# EAGLE design mcprog (EAGLE 6.6.0)
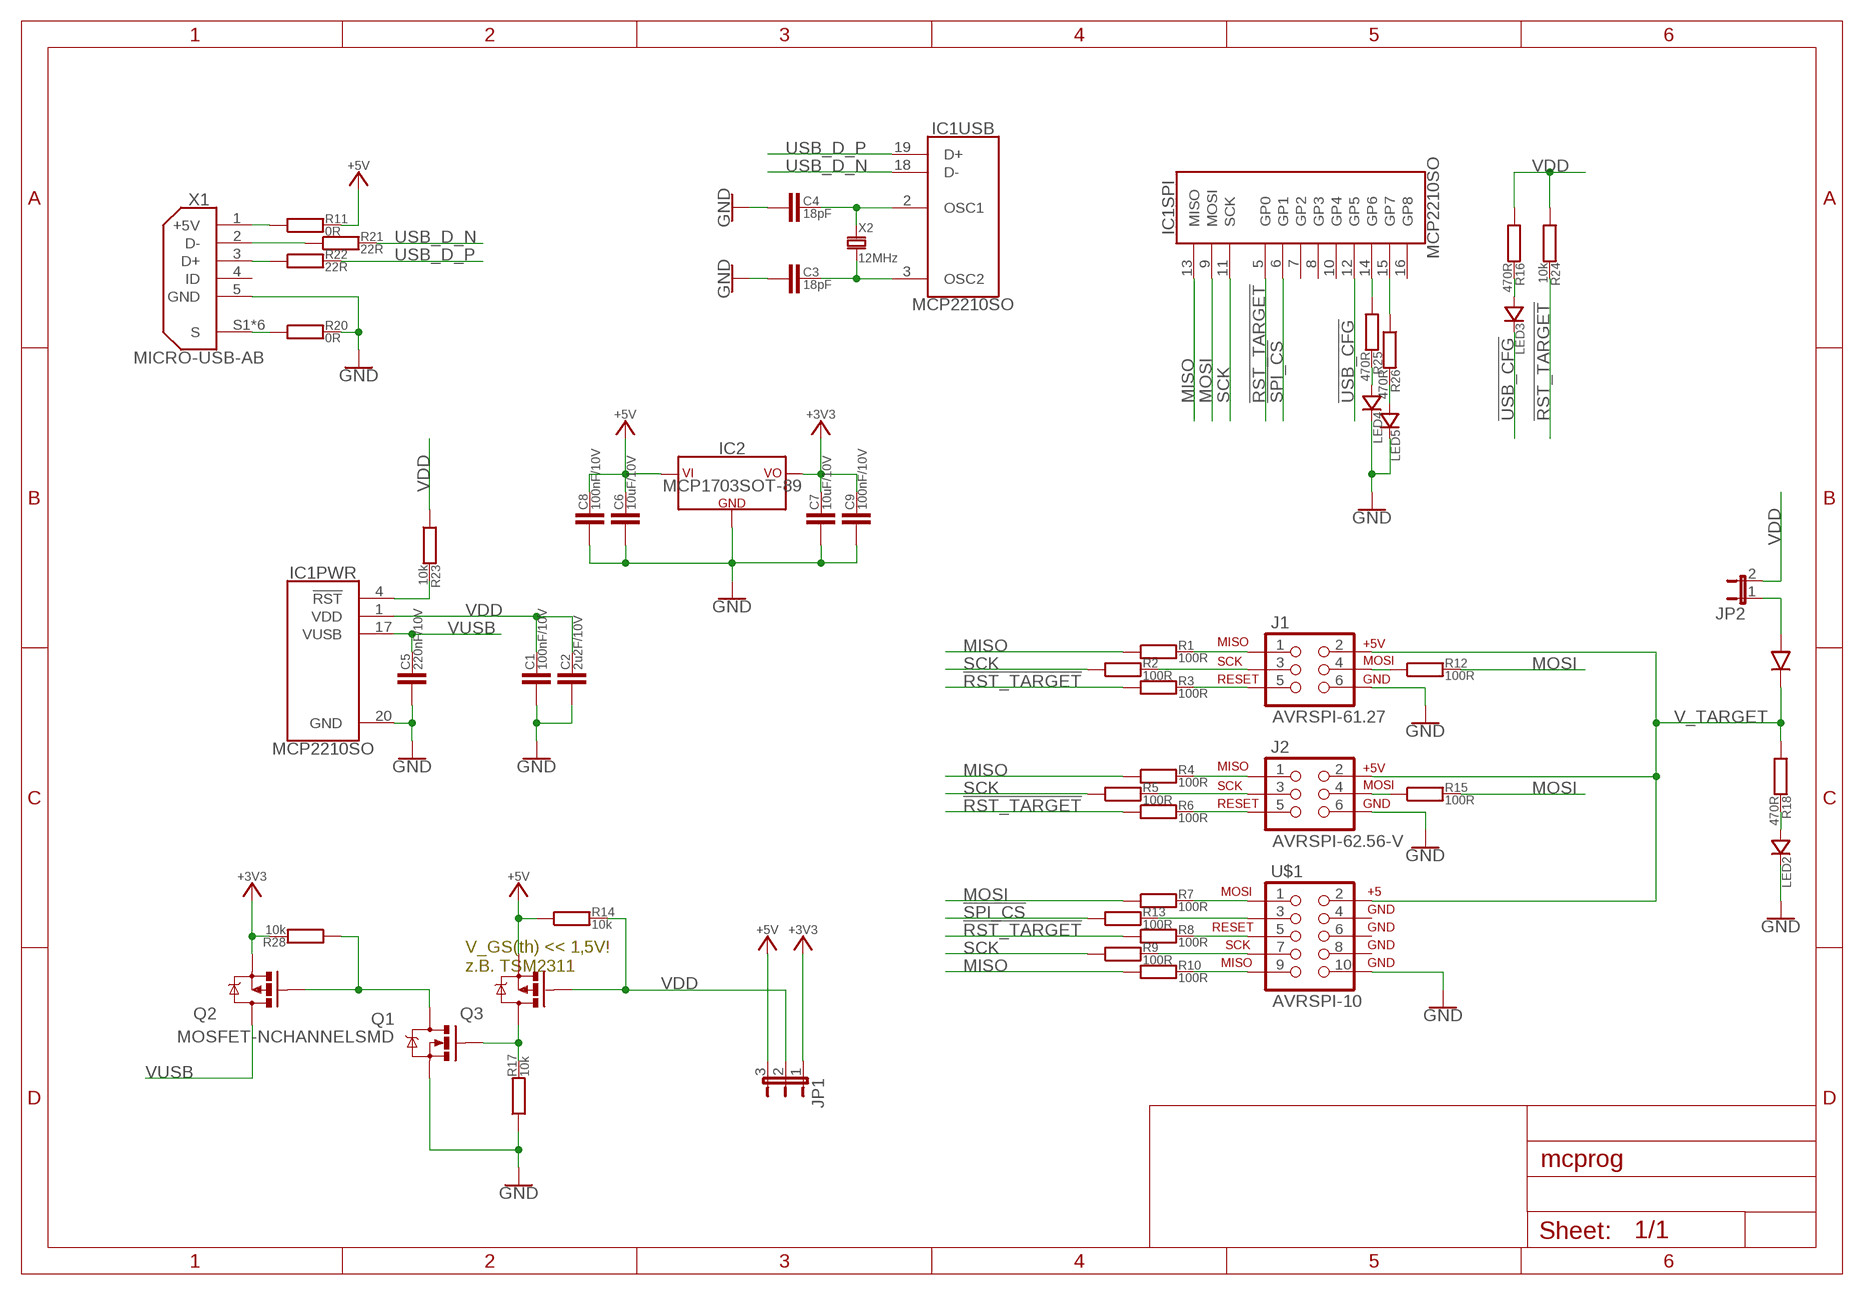
[diagram p0: schematic, sheet 1]

## Parts
C1  100nF/10V  C0603  [C0603]
C2  2u2F/10V  C1206  [C1206]
C3  18pF  C0603  [C0603]
C4  18pF  C0603  [C0603]
C5  220nF/10V  C0603  [C0603]
C6  10uF/10V  C1206  [C1206]
C7  10uF/10V  C1206  [C1206]
C8  100nF/10V  C0603  [C0603]
C9  100nF/10V  C0603  [C0603]
D1  1N5819HW  [SOD123]
IC1  MCP2210SO  [SOIC20-W]
IC2  MCP1703SOT-89  [SOT89]
J1  AVRSPI-61.27  [2X3-1.27]
J2  AVRSPI-62.56-V  [2X3-NS]
JP1  JP2E  [JP2]
JP2  JP1E  [JP1]
LED2  LED0603  [LED0603]
LED3  LED0603  [LED0603]
LED4  LED0603  [LED0603]
LED5  LED0603  [LED0603]
Q1  MOSFET-NCHANNELSMD  [SOT23-3]
Q2  MOSFET-PCHANNEL  [SOT23]
Q3  MOSFET-PCHANNEL  [SOT23]
R1  100R  R0603  [R0603]
R2  100R  R0603  [R0603]
R3  100R  R0603  [R0603]
R4  100R  R0603  [R0603]
R5  100R  R0603  [R0603]
R6  100R  R0603  [R0603]
R7  100R  R0603  [R0603]
R8  100R  R0603  [R0603]
R9  100R  R0603  [R0603]
R10  100R  R0603  [R0603]
R11  0R  R0603  [R0603]
R12  100R  R0603  [R0603]
R13  100R  R0603  [R0603]
R14  10k  R0603  [R0603]
R15  100R  R0603  [R0603]
R16  470R  R0603  [R0603]
R17  10k  R0603  [R0603]
R18  470R  R0603  [R0603]
R20  0R  R0603  [R0603]
R21  22R  R0603  [R0603]
R22  22R  R0603  [R0603]
R23  10k  R0603  [R0603]
R24  10k  R0603  [R0603]
R25  470R  R0603  [R0603]
R26  470R  R0603  [R0603]
R28  10k  R0603  [R0603]
U$1  AVRSPI-10  [AVR_ICSP]
X1  MICRO-USB-AB  [ZX62-B-5PA(11)]
X2  12MHz  CRYSTALHC49UP  [HC49UP]

## Nets
!RST_TARGET!: IC1.5(SPI:GP0) R3.1 R6.1 R8.1 R24.2
!SPI_CS!: IC1.6(SPI:GP1) R13.1
!USB_CFG!: IC1.12(SPI:GP5) LED3.C
+3V3: C7.2 C9.2 IC2.3(VCC) JP1.1 Q2.2(S) R28.2
+5V: C6.2 C8.2 IC2.2(VIN) IC2.4(VIN) JP1.3 Q3.2(S) R11.2 R14.1
GND: C1.1 C2.1 C3.1 C4.1 C5.1 C6.1 C7.1 C8.1 C9.1 IC1.20(PWR:GND) IC2.1(GND) J1.6(GND) J2.6(GND) LED2.C LED4.C LED5.C Q1.2(S) R17.1 R20.2 U$1.10 X1.5(GND)
MISO: IC1.13(SPI:MISO) R1.1 R4.1 R10.1
MOSI: IC1.9(SPI:MOSI) R7.1 R12.2 R15.2
N$1: J1.1(MISO) R1.2
N$2: J1.3(SCK) R2.2
N$3: J1.5(RESET) R3.2
N$4: J2.1(MISO) R4.2
N$5: J2.3(SCK) R5.2
N$6: J2.5(RESET) R6.2
N$7: R7.2 U$1.1
N$8: R8.2 U$1.5
N$9: R9.2 U$1.7
N$10: R10.2 U$1.9
N$11: Q1.1(G) Q3.3(D) R17.2
N$12: LED3.A R16.2
N$13: Q1.3(D) Q2.1(G) R28.1
N$14: J2.4(MOSI) R15.1
N$15: LED2.A R18.2
N$16: IC1.14(SPI:GP6) R25.1
N$17: J1.4(MOSI) R12.1
N$19: R13.2 U$1.3
N$20: C4.2 IC1.2(USB:OSC1) X2.1
N$21: C3.2 IC1.3(USB:OSC2) X2.2
N$22: R21.1 X1.2(D-)
N$23: R22.1 X1.3(D+)
N$24: R11.1 X1.1(+5V)
N$25: R20.1 X1.S1(S) X1.S2(S) X1.S3(S) X1.S4(S) X1.S5(S) X1.S6(S)
N$26: LED4.A R25.2
N$27: D1.A JP2.1
N$29: IC1.4(PWR:!RST!) R23.2
N$32: LED5.A R26.2
N$33: IC1.15(SPI:GP7) R26.1
SCK: IC1.11(SPI:SCK) R2.1 R5.1 R9.1
USB_D_N: IC1.18(USB:D-) R21.2
USB_D_P: IC1.19(USB:D+) R22.2
V_TARGET: D1.C J1.2(+5V) J2.2(+5V) R18.1 U$1.2
VDD: C1.2 C2.2 IC1.1(PWR:VDD) JP1.2 JP2.2 Q3.1(G) R14.2 R16.1 R23.1 R24.1
VUSB: C5.2 IC1.17(PWR:VUSB) Q2.3(D)
Unconnected: IC1.7(SPI:GP2) IC1.8(SPI:GP3) IC1.10(SPI:GP4) IC1.16(SPI:GP8) U$1.4 U$1.6 U$1.8 X1.4(ID)

## Notes on the sheet
- V_GS(th) << 1,5V!
  z.B. TSM2311

## Library data of the parts
C1-C9 = bytewerk-passive:C
D1 = bytewerk-passive:1N5819HW: Si-Diode - Icont=1A; MF: DIODES INC.; MPN: 1N5819HW-7-F; OC_FARNELL: 1773475
IC1 = mcp2210:MCP2210: USB to SPI Master Creative Commons v3.0 CC-BY-SA
IC2 = bytewerk-vreg:MCP1703
J1 J2 = bytewerk-con:AVRSPI-6: 6-PIN AVR ISP Connector
JP1 = jumper:JP2E: JUMPER
JP2 = jumper:JP1E: JUMPER
LED2-LED5 = bytewerk-led:LED0603
Q1 = bytewerk-transistor:MOSFET-NCHANNEL
Q2 Q3 = bytewerk-transistor:MOSFET-PCHANNEL
R1-R18 R20-R26 R28 = bytewerk-passive:R
U$1 = bytewerk-con:AVRSPI-10: AVR ICSP Header This is the standard AVR In Circuit Serial Programming header. Minimal, but includes pin one indicator. Works with standard Olimex programmers. Also look for the 6-pin reduced version. Spark Fun Electronics SKU: PRT-00778
X1 = bytewerk-con:MICRO-USB-AB; MF: HIROSE; MPN: ZX62-AB-5PA(11); OC_MOUSER: 798-ZX62-AB-5PA11
X2 = bytewerk-crystal:CRYSTAL

## Board
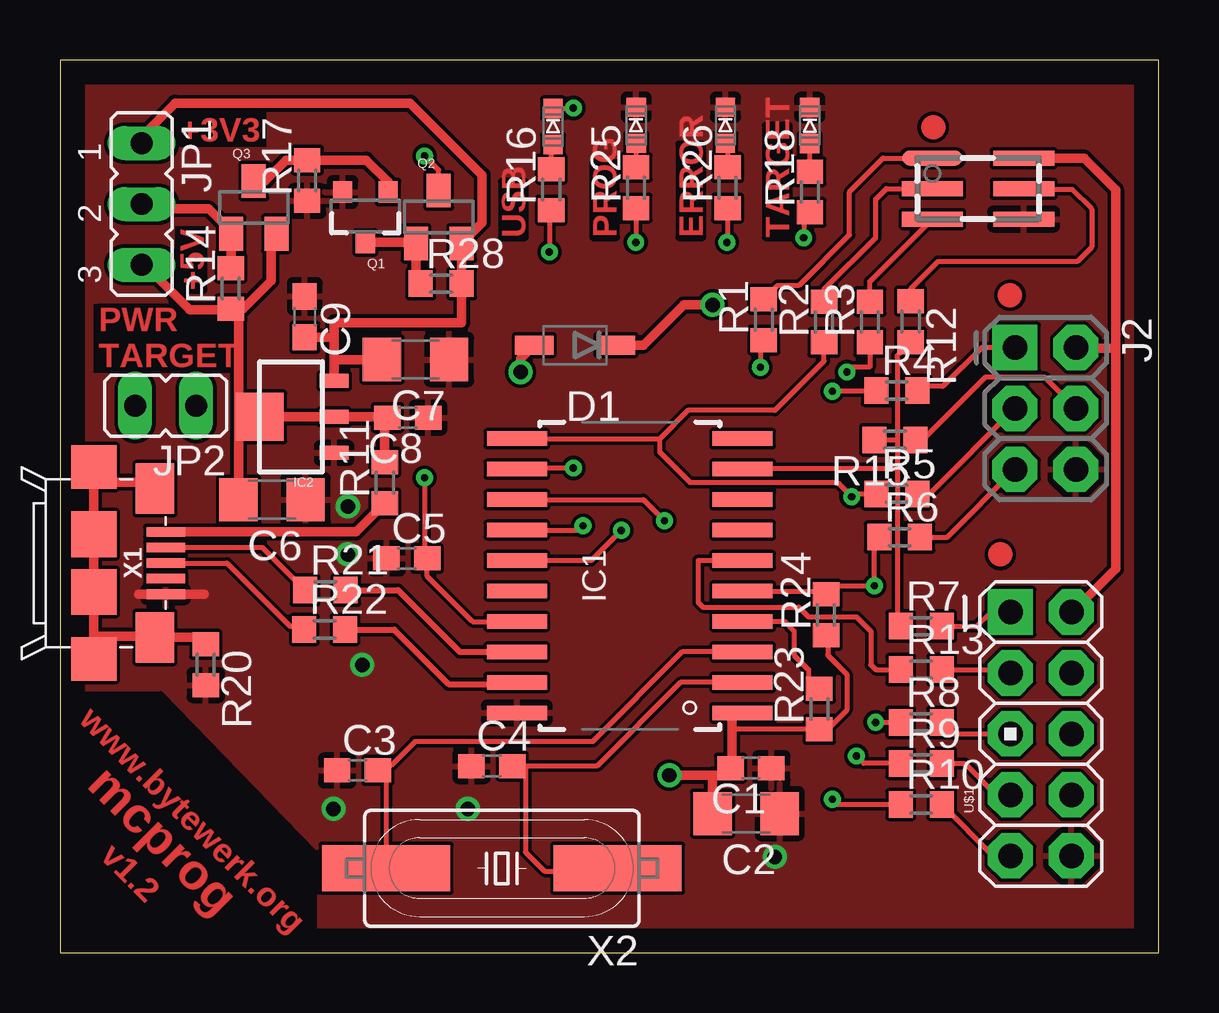
[diagram p1: board, top side]
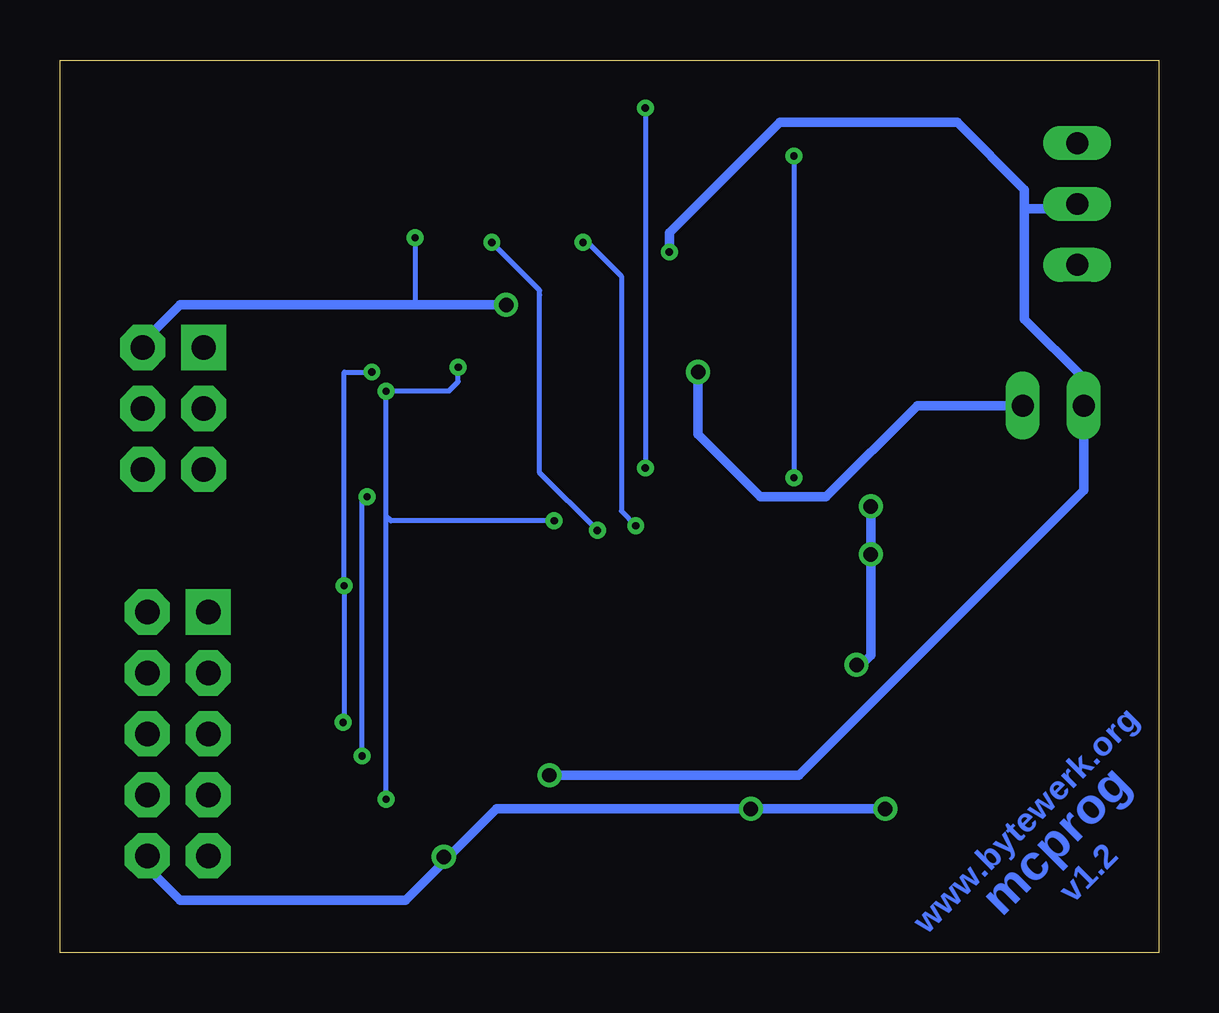
[diagram p2: board, bottom side, seen from below]

Size 45.8 x 37.2 mm. Coordinates in mm from the lower left corner, seen from the top.
Outline: 0,0 45.8,0 45.8,37.2 0,37.2 0,0
Copper layers (1*16): Top 0.035mm / dielectric 1.5mm / Bottom 0.035mm
Design rules "pro-2layer-cheap": minimum track width 0.15mm, minimum drill 0.3mm, track to track 0.15mm, track to pad 0.15mm, pad to pad 0.15mm, via to via 0.15mm, smd to smd 0.15mm, copper to edge 40mil, drill to drill 8mil, minimum pad ring 10mil, minimum via ring 8mil, stop-mask expansion 4mil, vias tented up to drill 0.3mm, thermal gap 10mil

### Footprints (pad centres in the part's own frame; a part is rotated, then mirrored left to right if it is on the bottom)
C0603 = smd 1.1 x 1: 1 -0.85,0; 2 0.85,0
C1206 = smd 1.6 x 1.8: 1 -1.4,0; 2 1.4,0
SOD123 = smd 1.6 x 0.8: A 1.7,0; C -1.7,0
SOIC20-W = smd 0.6 x 2.5: 1 -5.715,-4.7; 2 -4.445,-4.7; 3 -3.175,-4.7; 4 -1.905,-4.7; 5 -0.635,-4.7; 6 0.635,-4.7; 7 1.905,-4.7; 8 3.175,-4.7; 9 4.445,-4.7; 10 5.715,-4.7; 11 5.715,4.7; 12 4.445,4.7; 13 3.175,4.7; 14 1.905,4.7; 15 0.635,4.7; 16 -0.635,4.7; 17 -1.905,4.7; 18 -3.175,4.7; 19 -4.445,4.7; 20 -5.715,4.7
SOT89 = smd 0.58 x 1.2: 1 -1.5,-1.8; 2 0,-1.8; 3 1.5,-1.8 | smd 2 x 2: 4 0,1.3
2X3-1.27 = smd 0.635 x 2.54: 1 -1.27,-1.905; 2 -1.27,1.905; 3 0,-1.905; 4 0,1.905; 5 1.27,-1.905; 6 1.27,1.905
2X3-NS = drill 1.016 pad 1.88 square: 1 -2.54,-1.27 | drill 1.016 pad 1.88 octagon: 2 -2.54,1.27; 3 0,-1.27; 4 0,1.27; 5 2.54,-1.27; 6 2.54,1.27
JP2 = drill 0.914 long: 1 -2.54,0; 2 0,0; 3 2.54,0
JP1 = drill 0.914 long: 1 0,-1.27; 2 0,1.27
LED0603 = smd 0.8 x 0.8: A -0.75,0; C 0.75,0
SOT23-3 = smd 0.8 x 0.9: 1 -0.95,-1; 2 0.95,-1; 3 0,1.1
SOT23 = smd 1 x 1.4: 1 -0.95,-1.1; 2 0.95,-1.1; 3 0,1.1
R0603 = smd 1 x 1.1: 1 -0.85,0; 2 0.85,0
AVR_ICSP = drill 1.016 pad 1.88 square: 1 -1.27,5.08 | drill 1.016 pad 1.88 octagon: 2 1.27,5.08; 3 -1.27,2.54; 4 1.27,2.54; 5 -1.27,0; 6 1.27,0; 7 -1.27,-2.54; 8 1.27,-2.54; 9 -1.27,-5.08; 10 1.27,-5.08
ZX62-B-5PA(11) = smd 0.4 x 1.6: 1 -1.3,3; 2 -0.65,3; 3 0,3; 4 0.65,3; 5 1.3,3 | smd 2.1 x 1.6: S1 -3.1,2.55; S2 3.1,2.55 | smd 1.8 x 1.9: S3 -4,0; S4 4,0 | smd 1.9 x 1.9: S5 -1.2,0; S6 1.2,0
HC49UP = smd 5.334 x 1.93: 1 -4.826,0; 2 4.826,0

### Placement (x,y rotation side)
C1  28.8,7.7 180 top
C2  28.6,5.8 180 top
C3  12.4,7.6 0 top
C4  18,7.78 0 top
C5  14.46,16.43 0 top
C6  8.84,18.88 180 top
C7  14.82,24.72 180 top
C8  14.5,22.3 180 top
C9  10.2,26.5 270 top
D1  21.47,25.32 180 top
IC1  23.75,15.71 90 top
IC2  9.63,22.33 90 top
J1  38.27,31.84 270 top
J2  41.08,22.68 270 top
JP1  3.4,31.2 270 top
JP2  4.4,22.8 90 top
LED2  31.25,34.47 90 top
LED3  20.55,34.43 90 top
LED4  24.02,34.48 90 top
LED5  27.74,34.48 90 top
Q1  12.73,30.7 180 top
Q2  15.79,30.66 0 top
Q3  8.08,31.06 0 top
R1  29.34,26.38 90 top
R2  31.85,26.28 90 top
R3  33.76,26.28 90 top
R4  34.88,23.43 0 top
R5  34.88,19.12 0 top
R6  35,17.32 0 top
R7  35.9,13.61 0 top
R8  35.9,9.6 0 top
R9  35.9,7.89 0 top
R10  35.9,6.18 0 top
R11  13.54,19.59 90 top
R12  35.46,26.3 270 top
R13  35.9,11.8 0 top
R14  7.12,27.68 90 top
R15  34.8,21.37 180 top
R16  20.48,31.8 90 top
R17  10.3,32.18 90 top
R18  31.26,31.7 90 top
R20  6.08,12 270 top
R21  11.06,15.11 0 top
R22  11.03,13.47 0 top
R23  31.65,10.16 90 top
R24  31.93,14.08 90 top
R25  24.01,31.88 90 top
R26  27.83,31.88 90 top
R28  15.89,27.88 0 top
U$1  40.89,9.12 0 top
X1  1.41,16.24 270 top
X2  18.42,3.52 180 top

### Tracks (layer width: path | path; a pad name or v marks a point on that pad's centre or on a via)
!RST_TARGET!  (via drill 0.3)
  Top 0.2: IC1.5 31.93,15.07 R24.2 31.93,15.3 v33.95,15.3 33.95,17.32 R6.1 | v34,9.6 R8.1 | R3.1 33.76,24.4 33,24.4 v32.8,24.2
  Bottom 0.2: v34,9.6 33.95,9.65 v33.95,15.3 33.95,24.2 v32.8,24.2
!SPI_CS!
  Top 0.2: IC1.6 26.6,16.34 26.6,14.6 26.8,14.4 30.8,14.4 31.2,14 33.2,14 33.8,13.4 33.8,12 34,11.8 R13.1
!USB_CFG!  (via drill 0.3)
  Top 0.2: LED3.C 21.38,35.18 v21.4,35.2 | v21.4,20.2 19.09,20.2 IC1.12
  Bottom 0.2: v21.4,35.2 v21.4,20.2
+3V3
  Top 0.4: IC2.3 11.43,24.8 | 11.43,24.8 11.43,25.6 | 11.43,25.6 11.43,26.23 11.46,26.26 16.74,26.26 R28.2 Q2.2 17.6,30.42 17.6,32.4 14.6,35.4 4.8,35.4 3.4,34 JP1.1 | C7.2 11.51,24.72 11.43,24.8 | 11.43,25.6 11.38,25.65 C9.2
+5V
  Top 0.4: 8.33,22.54 IC2.4 | IC2.4 IC2.2 13.62,22.33 C8.2 13.54,22.19 R11.2 | 8.94,21.72 IC2.4 | IC2.4 8.06,22.6 7.44,22.6 | R14.1 7.63,26.83 8.8,28 8.8,29.73 Q3.2 | C6.2 7.44,22.6 | 7.44,22.6 7.44,26.83 R14.1 | JP1.3 3.54,28.66 5.4,26.8 7.09,26.8 R14.1
GND  (via drill 0.6)
  Top 0.4: 6,14.94 3.28,14.94
  Bottom 0.4: v12,18.6 12,12.4 12.4,12 v12.6,12 | 42.2,4 42.2,3.6 40.8,2.2 31.4,2.2 27.6,6 v17,6 v11.4,6
  other vias: 29.8,4 12,16.6
  pour Top: -0.2,36.2 44.9,36.2 44.9,0.2 -0.3,0.2
  cutout Top: 0,10.8 4.2,10.8 10.6,4.2 10.6,0 0,0
  cutout Top: 5,35 5,33.6 8.6,33.6 8.6,35
  cutout Top: 4.8,30.26 4.8,27.6 6.1,27.6 6.1,30.26
  cutout Top: 1.4,24.2 7,24.2 7,27 1.4,27
MISO  (via drill 0.3)
  Top 0.2: R4.1 34,23.4 v32.2,23.4 | R10.1 32.42,6.18 v32.2,6.4 | IC1.13 24.32,18.89 v25.2,18 | R1.1 29.2,25.39 v29.2,24.4
  Bottom 0.2: v32.2,6.4 32.2,18.2 | 32.2,18.2 v32.2,23.4 29.6,23.4 29.2,23.8 v29.2,24.4 | v25.2,18 32,18 32.2,18.2
MOSI
  Top 0.2: 34.9,20.2 28.5,20.2 arc90 IC1.9 | 34.9,21.37 34.9,24.8 34.9,24.89 R12.2 | 34.9,21.37 34.9,20.2 | R15.2 34.9,21.37 | 34.9,20.2 34.9,13.76 R7.1
N$1
  Top 0.2: R1.2 29.91,27.8 30.8,27.8 32.91,29.91 32.91,31.71 34.31,33.11 J1.1
N$2
  Top 0.2: R2.2 31.85,27.65 34,29.8 34,31.4 34.44,31.84 J1.3
N$3
  Top 0.2: R3.2 33.76,27.96 J1.5
N$4
  Top 0.2: J2.1 38.42,25.22 36.8,23.6 35.9,23.6 R4.2
N$5
  Top 0.2: R5.2 36.25,19.12 J2.3
N$6
  Top 0.2: R6.2 36.99,17.32 J2.5
N$7
  Top 0.2: R7.2 38.2,13.6 38.8,14.2 U$1.1
N$8
  Top 0.2: R8.2 37.23,9.12 U$1.5
N$9
  Top 0.2: R9.2 37.71,7.89 39.02,6.58 U$1.7
N$10
  Top 0.2: R10.2 38.89,4.04 U$1.9
N$11
  Top 0.4: R17.2 12.77,33.03 13.68,32.12 Q1.1 | 10.17,33.16 R17.2 | Q3.3 8.56,32.16 9.43,33.03 R17.2
N$12
  Top 0.2: R16.2 20.48,33.61 LED3.A
N$13
  Top 0.4: R28.1 14.84,28.08 Q2.1 14.8,29.6 Q1.3
N$14
  Top 0.2: J2.4 41.03,24 38.6,24 35.97,21.37 R15.1
N$15
  Top 0.2: R18.2 LED2.A
N$16  (via drill 0.3)
  Top 0.2: R25.1 v24,29.6 | IC1.14 21.61,17.61 v21.8,17.8
  Bottom 0.2: v24,29.6 23.8,29.6 22.4,28.2 22.4,18.4 v21.8,17.8
N$17
  Top 0.2: J1.4 40.22,31.8 42.2,31.8 43,31 43,29.4 42.4,28.8 36.6,28.8 35.46,27.66 R12.1
N$19
  Top 0.2: R13.2 38.4,11.8 39.48,11.8 U$1.3
N$20
  Top 0.2: IC1.2 25.86,11.27 22.38,7.78 19.4,7.78 | 19.4,7.78 C4.2 | 19.4,7.78 19.4,4.2 20.2,3.4 23.13,3.4 X2.1
N$21
  Top 0.2: IC1.3 25.93,12.54 22.2,8.8 14.8,8.8 13.8,7.8 13.45,7.8 C3.2 13.25,7.55 13.6,7.2 X2.2
N$22
  Top 0.2: X1.2 8.43,16.89 R21.1
N$23
  Top 0.2: X1.3 6.96,16.24 9.6,13.6 10.05,13.6 R22.1
N$24
  Top 0.4: X1.1 12.34,17.54 R11.1
N$25
  Top 0.4: X1.S4 1.41,13.2 | 1.41,13.2 X1.S6 X1.S5 1.41,19.6 | 1.41,19.6 X1.S3 | X1.S1 3.7,19.6 1.41,19.6 | X1.S2 3.9,13.2 1.41,13.2 | X1.S2 4.42,12.68 | R20.1 6.08,13.14 X1.S2
N$26
  Top 0.2: LED4.A R25.2
N$27  (via drill 0.6)
  Top 0.4: D1.A 19.2,24.75 v19.2,24.2
  Bottom 0.4: v19.2,24.2 19.2,21.6 16.6,19 13.87,19 10.07,22.8 JP2.1
N$29
  Top 0.2: IC1.4 30.2,13.8 30.6,13.4 30.6,12.4 31.2,11.8 31.2,11 31.21,11.01 R23.2 | 31.65,11.2 31.6,11.25
  Top 0.4: 31.65,11.2 R23.2
N$32
  Top 0.2: LED5.A 27.83,33.64 R26.2
N$33  (via drill 0.3)
  Top 0.2: v23.4,17.6 22.14,16.34 IC1.15 | R26.1 27.83,29.63 v27.8,29.6
  Bottom 0.2: v23.4,17.6 25.8,20 25.8,27.4 25.8,27.6 v27.8,29.6
SCK  (via drill 0.3)
  Top 0.2: R5.1 33,19.12 v33,19 32.4,19.6 26.25,19.6 25,20.85 25,21.43 | R9.1 33.51,7.89 v33.2,8.2 | IC1.11 25,21.43 | 25,21.43 26.18,22.6 29.8,22.6 31.85,24.65 R2.1
  Bottom 0.2: v33.2,8.2 33.2,19 v33,19
USB_D_N
  Top 0.254: R21.2 14.09,15.11 16.66,12.54 IC1.18
USB_D_P
  Top 0.254: R22.2 13.93,13.47 16.2,11.2 18.98,11.2 IC1.19
V_TARGET  (via drill 0.3, 0.6)
  Top 0.2: R18.1 31,30.85 v31,29.8
  Top 0.4: 44,25.2 44,16 42.2,14.2 U$1.2 | 44,25.2 42.35,25.2 J2.2 | 44,25.2 44,31.8 42.69,33.11 J1.2 | D1.C 24.32,25.32 26,27 v27.2,27
  Bottom 0.2: v31,29.8 31,27 31.2,27
  Bottom 0.4: v27.2,27 31.2,27 40.8,27 42.35,25.45 J2.2
VDD  (via drill 0.3, 0.6)
  Top 0.2: 20.48,30.88 R16.1 20.4,30.95 | 31.97,13.23 R24.1 32.37,13.23 32,12.86 32,12.4 32.8,11.6 32.8,10.11 32,9.31 R23.1 28,9.31 28,8.8 | 20.35,30.95 20.4,30.95 | 20.4,30.95 v20.4,29.2
  Top 0.4: 28.6,9.99 IC1.1 28,9.99 28,8.8 28,7.7 | 31.93,13 R24.1 | R14.2 Q3.1 7.13,30.07 6.2,31 3.6,31 JP1.2 | v25.4,7.4 27.2,7.4 | 27.2,7.4 28,7.4 28,7.7 | C2.2 27.2,7.4 | 28,7.7 C1.2
  Bottom 0.2: v20.4,29.2 20.2,29.2
  Bottom 0.4: v25.4,7.4 15,7.4 3.13,19.27 JP2.2 3.13,23.93 5.6,26.4 5.6,31 | v20.4,29.2 20.4,30 15.8,34.6 8.4,34.6 5.6,31.8 5.6,31.2 5.6,31 | 5.6,31 3.6,31 JP1.2
VUSB  (via drill 0.3)
  Top 0.2: IC1.17 17.2,13.8 15.31,15.69 C5.2 15.2,16.54 v15.2,19.8 | Q2.3 15.79,32.61 v15.2,33.2
  Bottom 0.2: v15.2,33.2 v15.2,19.8
(copper drawn outside any net)
  shapes: Top circle x3

### Text on the board
Top: +3V3 | USB | PROG | ERROR | TARGET | +5V | PWR / TARGET | www.bytewerk.org | mcprog | v1.2
Bottom: www.bytewerk.org | mcprog | v1.2
tStop: +3V3 | USB | PROG | ERROR | TARGET | +5V | PWR / TARGET | www.bytewerk.org | mcprog | v1.2
bStop: www.bytewerk.org | mcprog | v1.2